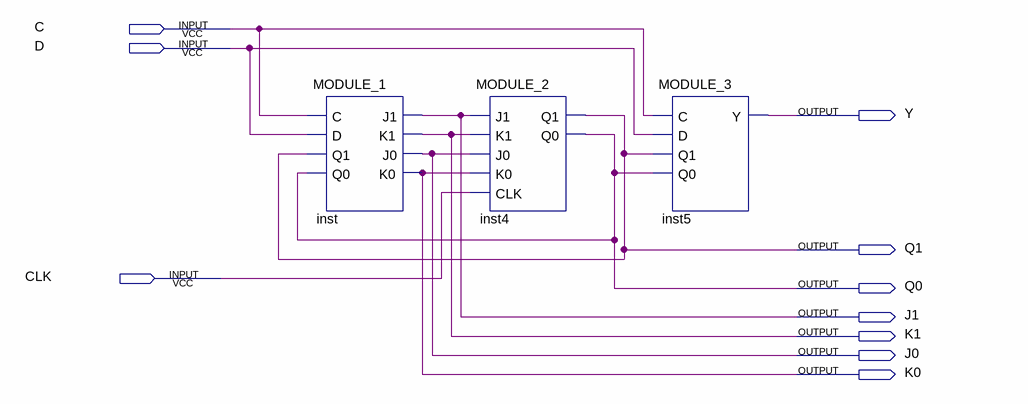
[diagram p0: schematic sheet]
// Quartus schematic MODULE_MOD_3_JKFF_ENCONDING_3.bdf as structural Verilog: 3 symbols, 10 pins
module MODULE_MOD_3_JKFF_ENCONDING_3 (
  input  C,
  input  D,
  input  CLK,
  output Y,
  output Q1,
  output Q0,
  output J1,
  output K1,
  output J0,
  output K0
);

  MODULE_1 inst (.C(C), .D(D), .Q1(Q1), .Q0(Q0), .J1(J1), .K1(K1), .J0(J0), .K0(K0));
  MODULE_2 inst4 (.J1(J1), .K1(K1), .J0(J0), .K0(K0), .CLK(CLK), .Q1(Q1), .Q0(Q0));
  MODULE_3 inst5 (.C(C), .D(D), .Q1(Q1), .Q0(Q0), .Y(Y));
endmodule
